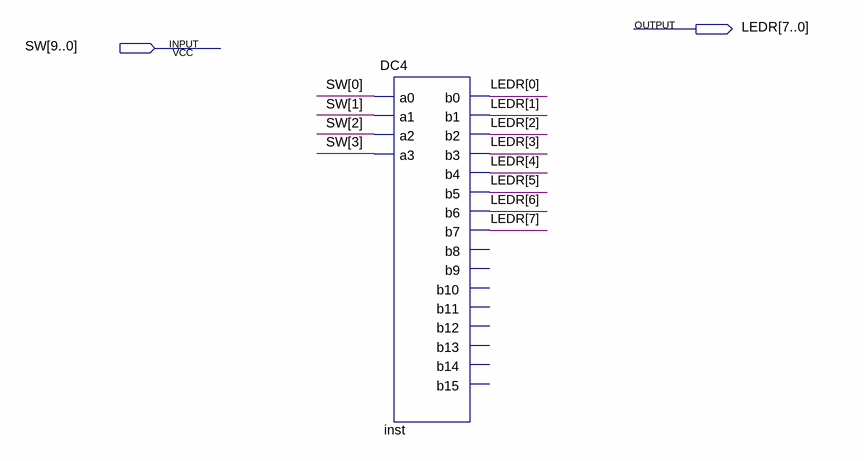
[diagram p0: schematic sheet]
// Quartus schematic top2.bdf as structural Verilog: 1 symbols, 2 pins
module top2 (
  input  [9:0] SW,
  output [7:0] LEDR
);

  DC4 inst (
    .a0(SW[0]), .a1(SW[1]), .a2(SW[2]), .a3(SW[3]), .b0(LEDR[0]), .b1(LEDR[1]), .b2(LEDR[2]), .b3(LEDR[3]),
    .b4(LEDR[4]), .b5(LEDR[5]), .b6(LEDR[6]), .b7(LEDR[7]));  // open: b8, b9, b10, b11, b12, b13, b14, b15
endmodule
